# Altium schematic sheet 06_LMS7002M_RF.SchDoc: LMS7002M RF
size A3; Organization: Lime Microsystems; Address1: Surrey Tech Centre; Address2: Guildford GU2 7YG; Address3: Surrey; Address4: United Kingdom; SheetNumber: 6
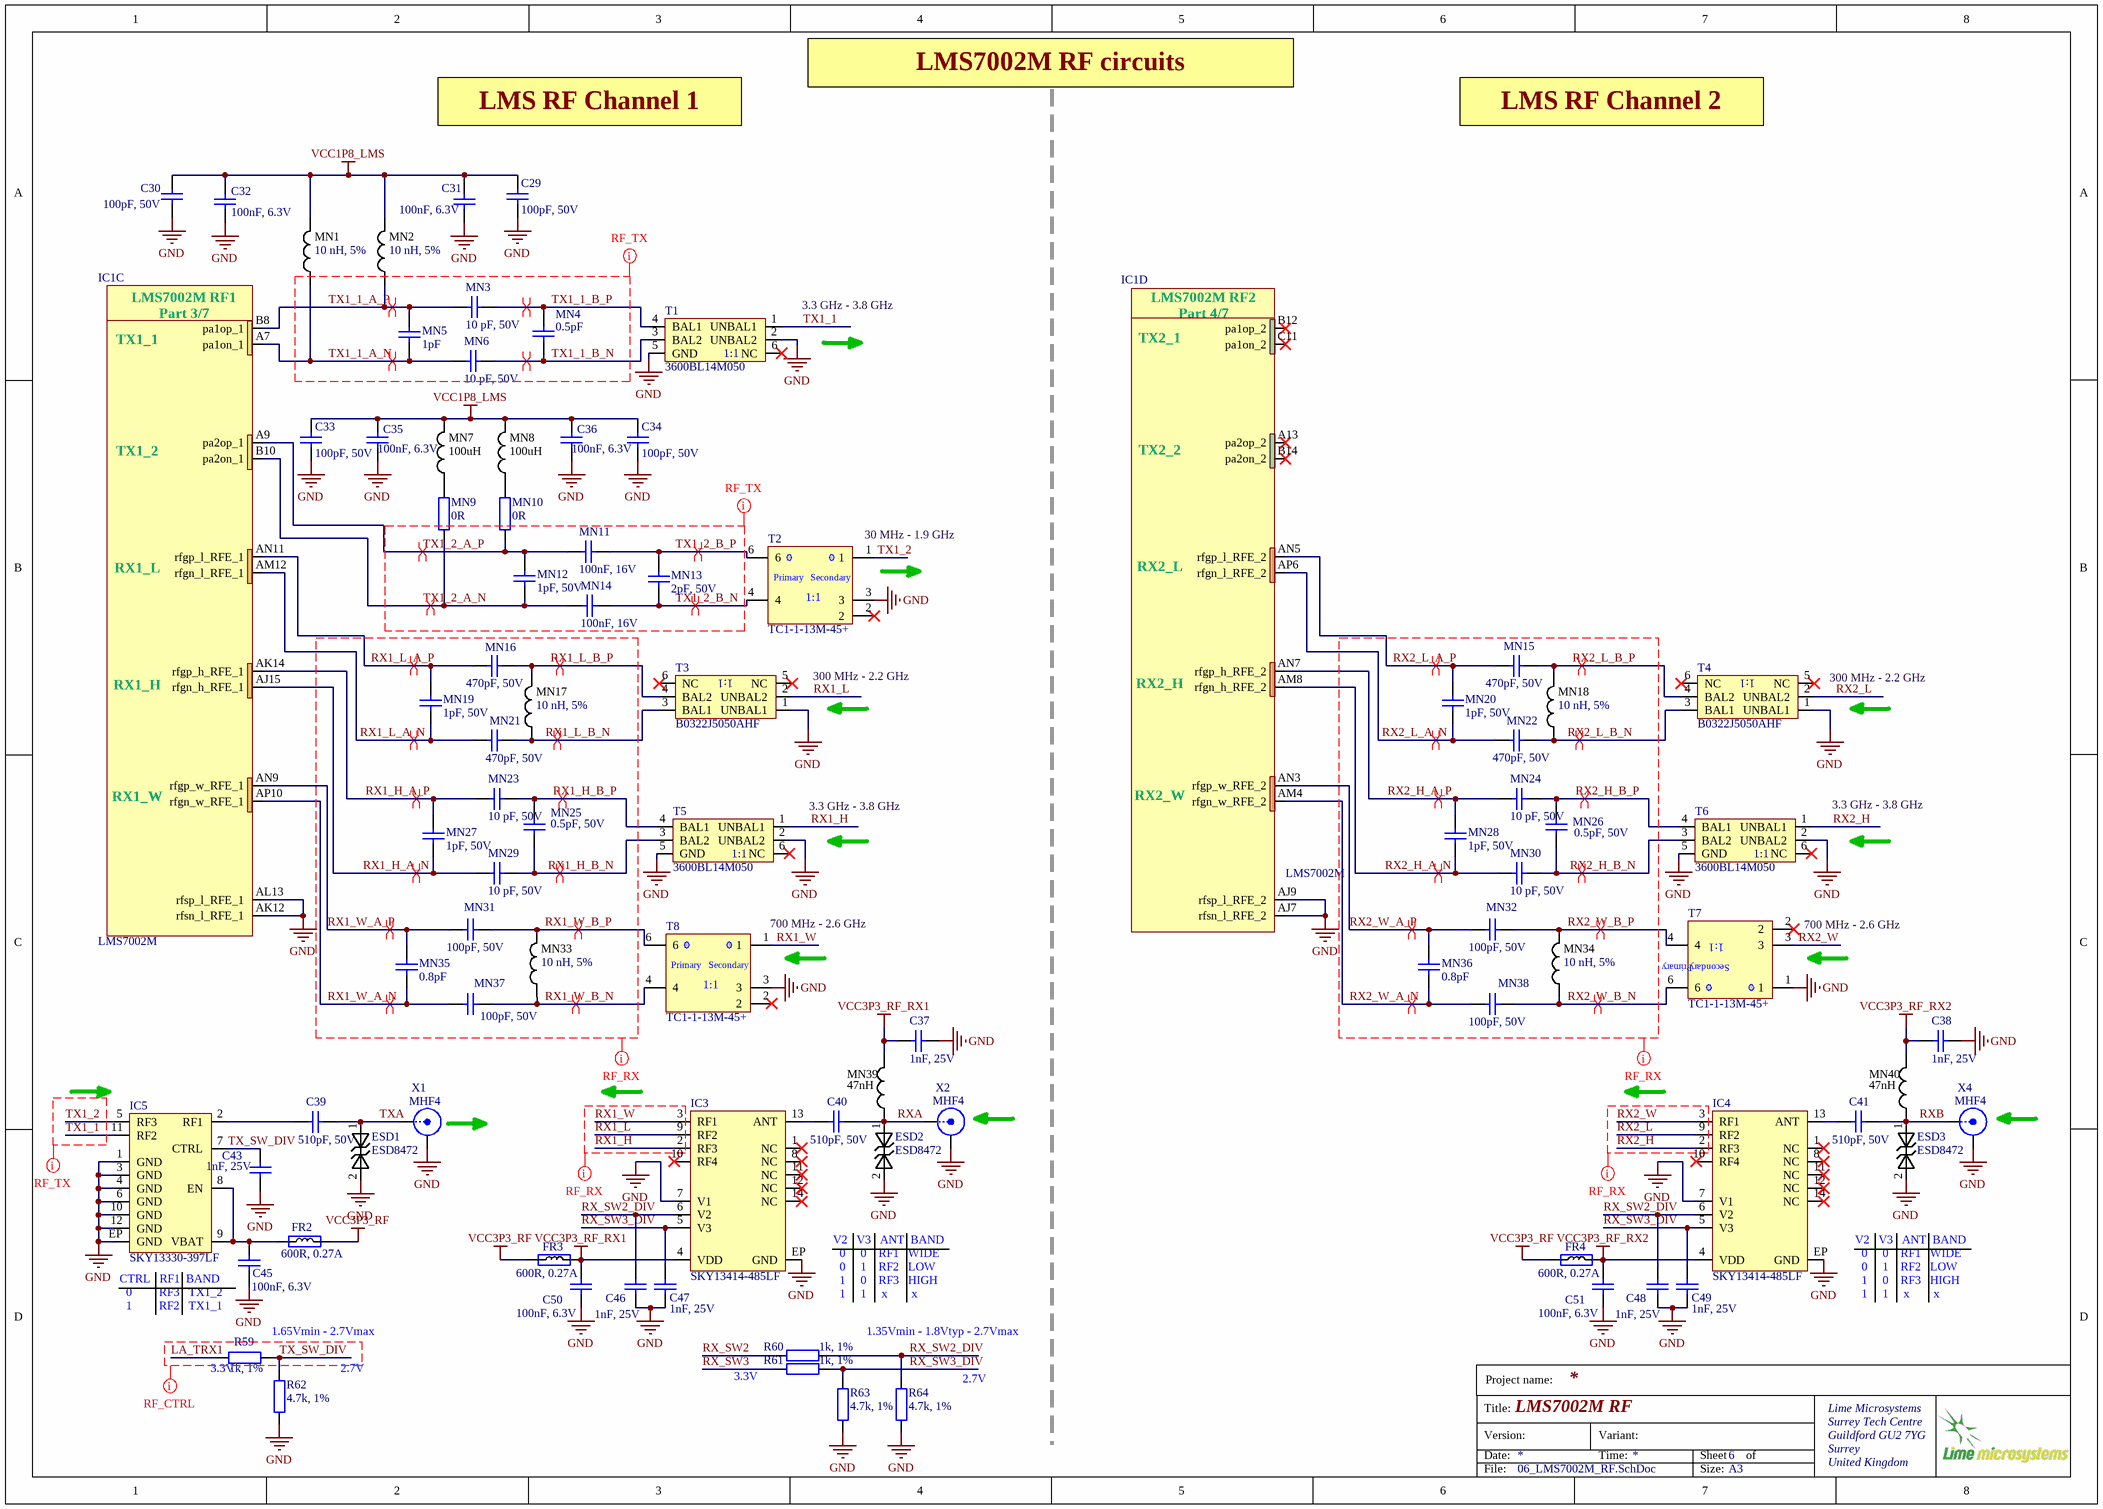
[diagram p0: 06_LMS7002M_RF.SchDoc]

## Parts
C29  100pF, 50V  [CAP0201]
C30  100pF, 50V  [CAP0201]
C31  100nF, 6.3V  [CAP0201]
C32  100nF, 6.3V  [CAP0201]
C33  100pF, 50V  [CAP0201]
C34  100pF, 50V  [CAP0201]
C35  100nF, 6.3V  [CAP0201]
C36  100nF, 6.3V  [CAP0201]
C37  1nF, 25V  [CAP0201]
C38  1nF, 25V  [CAP0201]
C39  510pF, 50V  [CAP0402]
C40  510pF, 50V  [CAP0402]
C41  510pF, 50V  [CAP0402]
C43  1nF, 25V  [CAP0201]
C45  100nF, 6.3V  [CAP0201]
C46  1nF, 25V  [CAP0201]
C47  1nF, 25V  [CAP0201]
C48  1nF, 25V  [CAP0201]
C49  1nF, 25V  [CAP0201]
C50  100nF, 6.3V  [CAP0201]
C51  100nF, 6.3V  [CAP0201]
ESD1  ESD8472  [ESD8472_X3DFN2]
ESD2  ESD8472  [ESD8472_X3DFN2]
ESD3  ESD8472  [ESD8472_X3DFN2]
FR2  600R, 0.27A  [RES0201]
FR3  600R, 0.27A  [RES0201]
FR4  600R, 0.27A  [RES0201]
IC1  LMS7002M  [LMS7002M_v5_LESS_SILK]  (parts C,D of 7)
IC3  SKY13414-485LF  [SKY13414-485LF_RF_SW_QFN14]
IC4  SKY13414-485LF  [SKY13414-485LF_RF_SW_QFN14]
IC5  SKY13330-397LF  [SKY13330-397LF_RF_SW_QFN12]
MN1  10 nH, 5%  [RES0402]
MN2  10 nH, 5%  [RES0402]
MN3  10 pF, 50V  [CAP0402]
MN4  0.5pF  [CAP0402]
MN5  1pF  [CAP0402]
MN6  10 pF, 50V  [CAP0402]
MN7  100uH  [RES0805]
MN8  100uH  [RES0805]
MN9  0R  [RES0402]
MN10  0R  [RES0402]
MN11  100nF, 16V  [CAP0402]
MN12  1pF, 50V  [CAP0402]
MN13  2pF, 50V  [CAP0402]
MN14  100nF, 16V  [CAP0402]
MN15  470pF, 50V  [CAP0402]
MN16  470pF, 50V  [CAP0402]
MN17  10 nH, 5%  [RES0402]
MN18  10 nH, 5%  [RES0402]
MN19  1pF, 50V  [CAP0402]
MN20  1pF, 50V  [CAP0402]
MN21  470pF, 50V  [CAP0402]
MN22  470pF, 50V  [CAP0402]
MN23  10 pF, 50V  [CAP0402]
MN24  10 pF, 50V  [CAP0402]
MN25  0.5pF, 50V  [CAP0402]
MN26  0.5pF, 50V  [CAP0402]
MN27  1pF, 50V  [CAP0402]
MN28  1pF, 50V  [CAP0402]
MN29  10 pF, 50V  [CAP0402]
MN30  10 pF, 50V  [CAP0402]
MN31  100pF, 50V  [CAP0402]
MN32  100pF, 50V  [CAP0402]
MN33  10 nH, 5%  [RES0402]
MN34  10 nH, 5%  [RES0402]
MN35  0.8pF  [CAP0402]
MN36  0.8pF  [CAP0402]
MN37  100pF, 50V  [CAP0402]
MN38  100pF, 50V  [CAP0402]
MN39  47nH  [RES0402]
MN40  47nH  [RES0402]
R59  1k, 1%  [RES0201]
R60  1k, 1%  [RES0201]
R61  1k, 1%  [RES0201]
R62  4.7k, 1%  [RES0201]
R63  4.7k, 1%  [RES0201]
R64  4.7k, 1%  [RES0201]
T1  3600BL14M050  [3600BL14M050_balun_0603]
T2  TC1-1-13M-45+  [TC1-1-13MA+_JA4220-AL_]
T3  B0322J5050AHF  [Anaren_0805_balun_B0322J5050AHF]
T4  B0322J5050AHF  [Anaren_0805_balun_B0322J5050AHF]
T5  3600BL14M050  [3600BL14M050_balun_0603]
T6  3600BL14M050  [3600BL14M050_balun_0603]
T7  TC1-1-13M-45+  [TC1-1-13MA+_JA4220-AL_]
T8  TC1-1-13M-45+  [TC1-1-13MA+_JA4220-AL_]
X1  MHF4  [IPEX_MHF4_conn]
X2  MHF4  [IPEX_MHF4_conn]
X4  MHF4  [IPEX_MHF4_conn]

## Nets
GND: C29.1 C30.1 C31.2 C32.2 C33.1 C34.1 C35.2 C36.2 C37.2 C38.2 C43.2 C45.2 C46.2 C47.2 C48.2 C49.2 C50.2 C51.2 ESD1.2 ESD2.2 ESD3.2 IC1.AJ7(rfsn_l_RFE_2) IC1.AJ9(rfsp_l_RFE_2) IC1.AK12(rfsn_l_RFE_1) IC1.AL13(rfsp_l_RFE_1) IC3.7(V1) IC3.EP(GND) IC4.7(V1) IC4.EP(GND) IC5.1(GND) IC5.3(GND) IC5.4(GND) IC5.6(GND) IC5.10(GND) IC5.12(GND) IC5.EP(GND) R62.2 R63.2 R64.2 T1.2(UNBAL2) T1.5(GND) T2.3 T3.1(UNBAL1) T4.1(UNBAL1) T5.2(UNBAL2) T5.5(GND) T6.2(UNBAL2) T6.5(GND) T7.1 T8.3 X1.2(Y) X2.2(Y) X4.2(Y)
VCC1P8_LMS: C29.2 C30.2 C31.1 C32.1 C33.2 C34.2 C35.1 C36.1 MN1.2 MN2.2 MN7.2 MN8.2
VCC3P3_RF: FR2.1 FR3.2 FR4.2
VCC3P3_RF_RX1: C37.1 C50.1 FR3.1 IC3.4(VDD) MN39.2
VCC3P3_RF_RX2: C38.1 C51.1 FR4.1 IC4.4(VDD) MN40.2
LA_TRX1: R59.2
RX1_H: IC3.2(RF3) T5.1(UNBAL1)
RX1_H_A_N: IC1.AJ15(rfgn_h_RFE_1) MN27.1 MN29.2
RX1_H_A_P: IC1.AK14(rfgp_h_RFE_1) MN23.2 MN27.2
RX1_H_B_N: MN25.1 MN29.1 T5.3(BAL2)
RX1_H_B_P: MN23.1 MN25.2 T5.4(BAL1)
RX1_L: IC3.9(RF2) T3.2(UNBAL2)
RX1_L_A_N: IC1.AM12(rfgn_l_RFE_1) MN19.1 MN21.2
RX1_L_A_P: IC1.AN11(rfgp_l_RFE_1) MN16.2 MN19.2
RX1_L_B_N: MN17.1 MN21.1 T3.3(BAL1)
RX1_L_B_P: MN16.1 MN17.2 T3.4(BAL2)
RX1_W: IC3.3(RF1) T8.1
RX1_W_A_N: IC1.AP10(rfgn_w_RFE_1) MN35.1 MN37.2
RX1_W_A_P: IC1.AN9(rfgp_w_RFE_1) MN31.2 MN35.2
RX1_W_B_N: MN33.1 MN37.1 T8.4
RX1_W_B_P: MN31.1 MN33.2 T8.6
RX2_H: IC4.2(RF3) T6.1(UNBAL1)
RX2_H_A_N: IC1.AM8(rfgn_h_RFE_2) MN28.1 MN30.2
RX2_H_A_P: IC1.AN7(rfgp_h_RFE_2) MN24.2 MN28.2
RX2_H_B_N: MN26.1 MN30.1 T6.3(BAL2)
RX2_H_B_P: MN24.1 MN26.2 T6.4(BAL1)
RX2_L: IC4.9(RF2) T4.2(UNBAL2)
RX2_L_A_N: IC1.AP6(rfgn_l_RFE_2) MN20.1 MN22.2
RX2_L_A_P: IC1.AN5(rfgp_l_RFE_2) MN15.2 MN20.2
RX2_L_B_N: MN18.1 MN22.1 T4.3(BAL1)
RX2_L_B_P: MN15.1 MN18.2 T4.4(BAL2)
RX2_W: IC4.3(RF1) T7.3
RX2_W_A_N: IC1.AM4(rfgn_w_RFE_2) MN36.1 MN38.2
RX2_W_A_P: IC1.AN3(rfgp_w_RFE_2) MN32.2 MN36.2
RX2_W_B_N: MN34.1 MN38.1 T7.6
RX2_W_B_P: MN32.1 MN34.2 T7.4
RX_SW2: R60.2
RX_SW2_DIV: C46.1 C48.1 IC3.6(V2) IC4.6(V2) R60.1 R64.1
RX_SW3: R61.2
RX_SW3_DIV: C47.1 C49.1 IC3.5(V3) IC4.5(V3) R61.1 R63.1
RXA: C40.1 ESD2.1 MN39.1 X2.1(X)
RXB: C41.1 ESD3.1 MN40.1 X4.1(X)
TX1_1: IC5.11(RF2) T1.1(UNBAL1)
TX1_1_A_N: IC1.A7(pa1on_1) MN1.1 MN5.1 MN6.2
TX1_1_A_P: IC1.B8(pa1op_1) MN2.1 MN3.1 MN5.2
TX1_1_B_N: MN4.2 MN6.1 T1.3(BAL2)
TX1_1_B_P: MN3.2 MN4.1 T1.4(BAL1)
TX1_2: IC5.5(RF3) T2.1
TX1_2_A_N: IC1.B10(pa2on_1) MN9.1 MN12.2 MN14.1
TX1_2_A_P: IC1.A9(pa2op_1) MN10.1 MN11.2 MN12.1
TX1_2_B_N: MN13.1 MN14.2 T2.4
TX1_2_B_P: MN11.1 MN13.2 T2.6
TX_SW_DIV: C43.1 IC5.7(CTRL) R59.1 R62.1
TXA: C39.1 ESD1.1 X1.1(X)
NetC39_2: C39.2 IC5.2(RF1)
NetC40_2: C40.2 IC3.13(ANT)
NetC41_2: C41.2 IC4.13(ANT)
NetC45_1: C45.1 FR2.2 IC5.8(EN) IC5.9(VBAT)
NetMN7_1: MN7.1 MN9.2
NetMN8_1: MN8.1 MN10.2

Not connected (* = marked no-connect by the designer): IC1 A13(pa2op_2)* B12(pa1op_2)* B14(pa2on_2)* C11(pa1on_2)*; IC3 1(NC)* 8(NC)* 10(RF4)* 11(NC)* 12(NC)* 14(NC)*; IC4 1(NC)* 8(NC)* 10(RF4)* 11(NC)* 12(NC)* 14(NC)*; T1 6(NC)*; T2 2*; T3 5(NC)* 6(NC)*; T4 5(NC)* 6(NC)*; T5 6(NC)*; T6 6(NC)*; T7 2*; T8 2*

## Layout directives
differential pair: RX1_H_A_N, RX1_H_A_P, RX1_H_B_N, RX1_H_B_P, RX1_L_A_N, RX1_L_A_P, RX1_L_B_N, RX1_L_B_P, RX1_W_A_N, RX1_W_A_P, RX1_W_B_N, RX1_W_B_P, RX2_H_A_N, RX2_H_A_P, RX2_H_B_N, RX2_H_B_P, RX2_L_A_N, RX2_L_A_P, RX2_L_B_N, RX2_L_B_P, RX2_W_A_N, RX2_W_A_P, RX2_W_B_N, RX2_W_B_P, TX1_1_A_N, TX1_1_A_P, TX1_1_B_N, TX1_1_B_P, TX1_2_A_N, TX1_2_A_P, TX1_2_B_N, TX1_2_B_P
net class RF_RX: RX1_H, RX1_H_A_N, RX1_H_A_P, RX1_H_B_N, RX1_H_B_P, RX1_L, RX1_L_A_N, RX1_L_A_P, RX1_L_B_N, RX1_L_B_P, RX1_W, RX1_W_A_N, RX1_W_A_P, RX1_W_B_N, RX1_W_B_P, RX2_H, RX2_H_A_N, RX2_H_A_P, RX2_H_B_N, RX2_H_B_P, RX2_L, RX2_L_A_N, RX2_L_A_P, RX2_L_B_N, RX2_L_B_P, RX2_W, RX2_W_A_N, RX2_W_A_P, RX2_W_B_N, RX2_W_B_P
net class RF_TX: TX1_1, TX1_1_A_N, TX1_1_A_P, TX1_1_B_N, TX1_1_B_P, TX1_2, TX1_2_A_N, TX1_2_A_P, TX1_2_B_N, TX1_2_B_P
net class RF_CTRL: LA_TRX1, TX_SW_DIV

## Notes on the sheet
- LMS7002M RF circuits
- LMS RF Channel 1
- LMS RF Channel 2
- (near T1) 3.3 GHz - 3.8 GHz
- (near T2) 30 MHz - 1.9 GHz
- 300 MHz - 2.2 GHz
- (near T4) 300 MHz - 2.2 GHz
- (near T5) 3.3 GHz - 3.8 GHz
- (near T6) 3.3 GHz - 3.8 GHz
- (near T8) 700 MHz - 2.6 GHz
- (near T7) 700 MHz - 2.6 GHz
- V2   V3   ANT  BAND
- 0     0    RF1   WIDE
- CTRL   RF1  BAND
- (near C45) 0         RF3   TX1_2
- 1         RF2   TX1_1
- 0     1    RF2   LOW
- 1     0    RF3   HIGH
- 1     1     x        x
- (near IC4) 0     1    RF2   LOW
- (near R59) 3.3V
- (near R59) 1.65Vmin - 2.7Vmax
- 2.7V
- 3.3V
- 1.35Vmin - 1.8Vtyp - 2.7Vmax
- (near R64) 2.7V
- Project name:
- Title:
- Version:
- Date:
- Variant:
- Time:
- Sheet
- of
- File:
- Size:
- A3
- (in symbol LMS7002Mr4, part C) LMS7002M RF1; Part 3/7; TX1_1; TX1_2; RX1_L; RX1_H; RX1_W
- (in symbol LMS7002Mr4, part D) LMS7002M RF2; Part 4/7; TX2_1; TX2_2; RX2_L; RX2_H; RX2_W
- (in symbol TC1-1-13M+) 1:1; Primary; Secondary

## Library data of the parts
C29 = Cap_0402: Part Description: 100 pF ±5% 50V Ceramic Capacitor C0G, NP0 0201 (0603 Metric); Manufacturer: TDK; Manufacturer Part Number 1: C0603C0G1H101J030BA; Dielectric Material: Ceramic; Tolerance: 5%; Dielectric: C0G; Insulation Resistance: 10GR; Value: 100pF, 50V; Supplier 1: Digi-Key; Supplier Part Number 1: 445-1786-1-ND; Stock 1: 367528; Pricing 1: 1=0,10000, 10=0,06000, 50=0,03280, 100=0,02670, 500=0,01908, 1000=0,01500, 2500=0,01364, 5000=0,01254 (USD); RoHS: Yes; Mount: Surface Mount; Case/Package: 0201; Number of Pins: 2; Case Code (Metric): 0603; Case Code (Imperial): 0201; Weight: 6E-06oz; Min Operating Temperature: -55°C; Max Operating Temperature: 125°C; Package Quantity: 1; Capacitance: 100pF; Voltage Rating: 50V; Packaging: Tape and Reel; Voltage Rating (DC): 50V; Termination: SMD/SMT; Voltage: 50V; Series: C; Construction: Flat; Length: 0.6mm; Width: 0.012inch; Height: 0.3mm; Thickness: 0.013inch; Depth: 0.3mm; Reach SVHC Compliant: Yes; Lead Free: Lead Free; RoHS Compliant: Yes; ComponentLink1URL: https://datasheet.ciiva.com/24217/c0603c0g1h101j030ba-264106-24217425.pdf?src-supplier=Mouser; ComponentLink1Description: https://datasheet.ciiva.com/24217/c0603c0g1h101j030ba-264106-24217425.pdf?src-supplier=Mouser; ComponentLink2URL: https://datasheet.ciiva.com/16205/mlcc-commercial-general-en-16205590.pdf?src-supplier=Future+Electronics; ComponentLink2Description: https://datasheet.ciiva.com/16205/mlcc-commercial-general-en-16205590.pdf?src-supplier=Future+Electronics; ComponentLink3URL: https://datasheet.ciiva.com/6250/tdkmlcccaprange-6250351.pdf?src-supplier=Digi-Key; ComponentLink3Description: https://datasheet.ciiva.com/6250/tdkmlcccaprange-6250351.pdf?src-supplier=Digi-Key
C30 C33 C34 = Cap_0402: Part Description: 100 pF ±5% 50V Ceramic Capacitor C0G, NP0 0201 (0603 Metric); Manufacturer: TDK; Manufacturer Part Number 1: C0603C0G1H101J030BA; Dielectric: C0G; Dielectric Material: Ceramic; Insulation Resistance: 10GR; Tolerance: 5%; Value: 100pF, 50V; Capacitance: 100pF; Case/Package: 0201; Case Code (Imperial): 0201; Case Code (Metric): 0603; ComponentLink1Description: https://datasheet.ciiva.com/24217/c0603c0g1h101j030ba-264106-24217425.pdf?src-supplier=Mouser; ComponentLink1URL: https://datasheet.ciiva.com/24217/c0603c0g1h101j030ba-264106-24217425.pdf?src-supplier=Mouser; ComponentLink2Description: https://datasheet.ciiva.com/16205/mlcc-commercial-general-en-16205590.pdf?src-supplier=Future+Electronics; ComponentLink2URL: https://datasheet.ciiva.com/16205/mlcc-commercial-general-en-16205590.pdf?src-supplier=Future+Electronics; ComponentLink3Description: https://datasheet.ciiva.com/6250/tdkmlcccaprange-6250351.pdf?src-supplier=Digi-Key; ComponentLink3URL: https://datasheet.ciiva.com/6250/tdkmlcccaprange-6250351.pdf?src-supplier=Digi-Key; Construction: Flat; Depth: 0.3mm; Height: 0.3mm; Lead Free: Lead Free; Length: 0.6mm; Max Operating Temperature: 125°C; Min Operating Temperature: -55°C; Mount: Surface Mount; Number of Pins: 2; Package Quantity: 1; Packaging: Tape and Reel; Pricing 1: 1=0,10000, 10=0,06000, 50=0,03280, 100=0,02670, 500=0,01908, 1000=0,01500, 2500=0,01364, 5000=0,01254 (USD); Reach SVHC Compliant: Yes; RoHS: Yes; RoHS Compliant: Yes; Series: C; Stock 1: 367528; Supplier 1: Digi-Key; Supplier Part Number 1: 445-1786-1-ND; Termination: SMD/SMT; Thickness: 0.013inch; Voltage: 50V; Voltage Rating (DC): 50V; Voltage Rating: 50V; Weight: 6E-06oz; Width: 0.012inch
C31 C32 C36 C45 C50 C51 = Cap_0402: Part Description: 0.1 µF ±20% 10V Ceramic Capacitor X5R 0201 (0603 Metric); Manufacturer: Samsung; Manufacturer Part Number 1: CL03A104MP3NNNC; Tolerance: 20%; Voltage Rating (DC): 10V; Value: 100nF, 6.3V; Capacitance: 100nF; Case/Package: 0201; Case Code (Imperial): 0201; Case Code (Metric): 0603; ComponentLink5Description: https://datasheet.ciiva.com/25788/cl03a104mp3nnnc-25788272.pdf?src-supplier=Digi-Key; ComponentLink5URL: https://datasheet.ciiva.com/25788/cl03a104mp3nnnc-25788272.pdf?src-supplier=Digi-Key; Length: 0.024inch; Max Operating Temperature: 85°C; Min Operating Temperature: -55°C; Mount: Surface Mount; Package Quantity: 1; Packaging: Tape and Reel; Pricing 1: 1=0,10000, 10=0,03000, 50=0,01640, 100=0,01330, 500=0,00950, 1000=0,00747, 2500=0,00679, 5000=0,00625 (USD); RoHS: Yes; RoHS Compliant: Yes; Series: CL; Stock 1: 3817176; Supplier 1: Digi-Key; Supplier Part Number 1: 1276-1321-1-ND; Thickness: 0.013inch; Voltage Rating: 10V; Width: 0.012inch
C35 = Cap_0402: Part Description: 0.1 µF ±20% 10V Ceramic Capacitor X5R 0201 (0603 Metric); Manufacturer: Samsung; Manufacturer Part Number 1: CL03A104MP3NNNC; Tolerance: 20%; Voltage Rating: 10V; Value: 100nF, 6.3V; Supplier 1: Digi-Key; Supplier Part Number 1: 1276-1321-1-ND; Stock 1: 3817176; Pricing 1: 1=0,10000, 10=0,03000, 50=0,01640, 100=0,01330, 500=0,00950, 1000=0,00747, 2500=0,00679, 5000=0,00625 (USD); RoHS: Yes; Mount: Surface Mount; Case/Package: 0201; Case Code (Metric): 0603; Case Code (Imperial): 0201; Min Operating Temperature: -55°C; Max Operating Temperature: 85°C; Package Quantity: 1; Packaging: Tape and Reel; Capacitance: 100nF; Voltage Rating (DC): 10V; Series: CL; Length: 0.024inch; Width: 0.012inch; Thickness: 0.013inch; RoHS Compliant: Yes; ComponentLink5URL: https://datasheet.ciiva.com/25788/cl03a104mp3nnnc-25788272.pdf?src-supplier=Digi-Key; ComponentLink5Description: https://datasheet.ciiva.com/25788/cl03a104mp3nnnc-25788272.pdf?src-supplier=Digi-Key
C37 C38 C43 C46-C49 = Cap_0402: Manufacturer Part Number 1: C0603X7R1E102K030BA; Manufacturer: TDK Corporation; Part Description: 1000pF ±10% 25V X7R Ceramic Capacitor -55°C ~ 125°C Surface Mount, MLCC 0201 (0603 Metric) 0.024" L x 0.012" W (0.60mm x 0.30mm); Temperature Coefficient: X7R; Tolerance: ±10%; Capacitance: 1000pF; Value: 1nF, 25V; Supplier 1: Digi-Key; Supplier Part Number 1: 445-7275-1-ND; Voltage - Rated: 25V; Features: -; Package / Case: 0201 (0603 Metric); Lead Spacing: -; Mounting Type: Surface Mount, MLCC; Lead Style: -; Height - Seated (Max): -; Operating Temperature: -55°C ~ 125°C; Size / Dimension: 0.024" L x 0.012" W (0.60mm x 0.30mm); Applications: General Purpose; Ratings: -; Thickness (Max): 0.013" (0.33mm); RoHS: RoHS Compliant; Packaging: Cut Tape (CT); Category: Capacitors
C39-C41 = Cap_0402: Manufacturer: Murata Electronics North America; Manufacturer Part Number 1: GRM1555C1H511JA01D; Part Description: 510pF ±5% 50V C0G, NP0 Ceramic Capacitor -55°C ~ 125°C Surface Mount, MLCC 0402 (1005 Metric) 0.039" L x 0.020" W (1.00mm x 0.50mm); Temperature Coefficient: C0G, NP0; Tolerance: ±5%; Value: 510pF, 50V; Supplier 1: Digi-Key; Supplier Part Number 1: 490-3237-1-ND; Height - Seated (Max): -; Features: -; Voltage - Rated: 50V; Size / Dimension: 0.039" L x 0.020" W (1.00mm x 0.50mm); Applications: General Purpose; Lead Spacing: -; Package / Case: 0402 (1005 Metric); Ratings: -; Thickness (Max): 0.022" (0.55mm); Lead Style: -; Operating Temperature: -55°C ~ 125°C; Mounting Type: Surface Mount, MLCC; Capacitance: 510pF; Category: Capacitors; RoHS: RoHS Compliant; Packaging: Cut Tape (CT)
ESD1-ESD3 = ESD8472: Manufacturer: ON Semiconductor; Manufacturer Part Number 1: ESD8472MUT5G; Part Description: TVS DIODE 5.3VWM 14VC X3DFN2; Voltage - Reverse Standoff (Typ): 5.3V (Max); Voltage - Breakdown (Min): 7V; Voltage - Clamping (Max) @ Ipp: 14V; Current - Peak Pulse (10/1000µs): 3A (8/20µs); Power Line Protection: No; Capacitance @ Frequency: 0.2pF @ 1MHz; Supplier 1: Digi-Key; RoHS: RoHS Compliant; Category: Circuit Protection; Stock 1: 2295; Pricing 1: 1=0.39, 10=0.315, 100=0.2142, 500=0.16068, 1000=0.12051 (USD); Packaging: Cut Tape (CT); Part Status: Active; Type: Zener; Power - Peak Pulse: -; Applications: Automotive, RF Antenna; Operating Temperature: -55°C ~ 150°C (TJ); Mounting Type: Surface Mount; Package / Case: 2-XFDFN; Supplier Device Package: 2-X3DFN (0.62x0.32); ComponentLink1URL: http://www.onsemi.com/pub/Collateral/ESD8472-D.PDF; ComponentLink1Description: http://www.onsemi.com/pub/Collateral/ESD8472-D.PDF; Supplier Part Number 1: ESD8472MUT5GOSCT-ND
FR2-FR4 = Ferrite: Manufacturer Part Number 1: BK0603TS601-T; Manufacturer: Taiyo Yuden; Part Description: FERRITE BEAD 600 OHM 0201 1LN; DC Resistance (DCR): 750 mOhm Max; Filter Type: Differential Mode - Single; Impedance @ Frequency: 600 Ohm @ 100MHz; Current Rating: 270mA; Value: 600R@100MHz; Supplier 1: Digi-Key; Supplier Part Number 1: 587-3277-1-ND; Size / Dimension: 0.024" L x 0.012" W (0.60mm x 0.30mm); Package / Case: 0201 (0603 Metric); Height (Max): 0.013" (0.33mm); Mounting Type: Surface Mount; Packaging: Cut Tape (CT); RoHS: RoHS Compliant; Category: Filters
IC1 = LMS7002Mr4: Schematic symbol revision 4. Default footprint - 0.31mm pad; Manufacturer: Lime Microsystems; Part Description: IC FPRF Transceiver LMS7002M; 261 pin aQFN; Supplier 1: Lime Microsystems; Supplier Part Number 1: LMS7002M; Manufacturer Part Number 1: LMS7002M
IC3 IC4 = SKY13414-485LF_RF_SW: Part Description: RF Switch IC General Purpose SP4T 3 GHz 50Ohm 14-QFN (2x2); Manufacturer: Skyworks Solutions; P1dB: 37dBm; Impedance: 50R; Throw Configuration: SP4T; IIP3: 70dBm; Supplier 1: Digi-Key; Supplier Part Number 1: 863-1582-1-ND; Manufacturer Part Number 1: SKY13414-485LF; Stock 1: 43522; Pricing 1: 1=1,35000, 10=1,20700, 25=1,14520, 100=0,94070, 250=0,87936, 500=0,77710, 1000=0,61350 (USD); RoHS: Yes; Case/Package: QFN; Min Operating Temperature: -40°C; Max Operating Temperature: 85°C; Packaging: Tape and Reel; Package Quantity: 3000; RoHS Compliant: Yes; ComponentLink1URL: https://datasheet.ciiva.com/15309/sky13414-485lf-201689g-231640-15309794.pdf?src-supplier=Mouser; ComponentLink1Description: https://datasheet.ciiva.com/15309/sky13414-485lf-201689g-231640-15309794.pdf?src-supplier=Mouser
IC5 = SKY13330-397LF_RF_SW: Part Description: RF Switch IC W-CDMA SPDT 6 GHz 50Ohm 12-QFN (2x2); Manufacturer: Skyworks Solutions; Frequency: 100MHz; Throw Configuration: SPDT; P1dB: 39dBm; Impedance: 50R; Insertion Loss: 0.65dB; Turn-Off Delay Time: 1.6us; Max Frequency: 6GHz; Supplier 1: Digi-Key; Supplier Part Number 1: 863-1643-1-ND; Manufacturer Part Number 1: SKY13330-397LF; Stock 1: 596826; Pricing 1: 1=0,99000, 10=0,88800, 25=0,84280, 100=0,69230, 250=0,64716, 500=0,57190, 1000=0,45150 (USD); RoHS: Yes; Mount: Surface Mount; Case/Package: QFN; Number of Pins: 12; Contact Plating: Tin,Matte; Weight: 0.000776oz; Min Operating Temperature: -40°C; Max Operating Temperature: 85°C; Packaging: Tape and Reel; Package Quantity: 3000; Turn-On Delay Time: 1.6us; Radiation Hardening: No; ComponentLink1URL: https://datasheet.ciiva.com/15100/getdatasheetpartid-656010-15100460.pdf?src-supplier=Verical; ComponentLink1Description: https://datasheet.ciiva.com/15100/getdatasheetpartid-656010-15100460.pdf?src-supplier=Verical
MN1 MN2 MN17 MN18 MN33 MN34 = Inductor_0603: Manufacturer: Murata; Manufacturer Part Number 1: LQW15AN10NJ00D; Part Description: RF Inductors - SMD 10 NH 5%; Core Material: Air,Ferrite; Current Rating: 500mA; Shielding: Unshielded; Q Factor: 25; Self Resonant Frequency: 5.5GHz; Inductance: 10nH; DC Resistance (DCR): 170mR; Test Frequency: 100MHz; Supplier 1: Digi-Key; Supplier Part Number 1: 490-1146-6-ND; Stock 1: 158333; Pricing 1: 1=0,16000, 10=0,14200, 25=0,12600, 50=0,10720, 100=0,09450, 250=0,08664, 500=0,07876, 1000=0,06615, 2500=0,05670 (USD); RoHS: Yes; Mount: Surface Mount; Case/Package: 0402; Weight: 2.8E-05oz; Case Code (Metric): 1005; Case Code (Imperial): 0402; Min Operating Temperature: -55°C; Max Operating Temperature: 125°C; Tolerance: 5%; Package Quantity: 10000; Packaging: Tape and Reel; Max DC Current: 500mA; Termination: SMD/SMT; Resistor Type: Wirewound; DC Current: 500mA; Series: LQW15A_00; Rated Current-Max: 500mA; Length: 1mm; Width: 0.02inch; Height: 0.5mm; Depth: 0.7mm; Radiation Hardening: No; Military Standard: Not; Lead Free: Lead Free; RoHS Compliant: Yes; ComponentLink1URL: https://datasheet.ciiva.com/11799/0900766b8090d800-11799037.pdf?src-supplier=RSComponents; ComponentLink1Description: https://datasheet.ciiva.com/11799/0900766b8090d800-11799037.pdf?src-supplier=RSComponents; ComponentLink2URL: https://datasheet.ciiva.com/1042/l0075s0080lqw15a-00-1042162.pdf?src-supplier=Digi-Key; ComponentLink2Description: https://datasheet.ciiva.com/1042/l0075s0080lqw15a-00-1042162.pdf?src-supplier=Digi-Key; ComponentLink3URL: https://datasheet.ciiva.com/1042/l0075s0080lqw15a-00-1042163.pdf?src-supplier=Digi-Key; ComponentLink3Description: https://datasheet.ciiva.com/1042/l0075s0080lqw15a-00-1042163.pdf?src-supplier=Digi-Key; ComponentLink4URL: https://datasheet.ciiva.com/1042/l0075s0080lqw15a-00-1042164.pdf?src-supplier=Digi-Key; ComponentLink4Description: https://datasheet.ciiva.com/1042/l0075s0080lqw15a-00-1042164.pdf?src-supplier=Digi-Key; ComponentLink5URL: https://datasheet.ciiva.com/8508/l0075s0080lqw15a-00-8508743.pdf?src-supplier=Avnet; ComponentLink5Description: https://datasheet.ciiva.com/8508/l0075s0080lqw15a-00-8508743.pdf?src-supplier=Avnet; ComponentLink6URL: https://datasheet.ciiva.com/18089/getdatasheetpartid-110925-18089287.pdf?src-supplier=Verical; ComponentLink6Description: https://datasheet.ciiva.com/18089/getdatasheetpartid-110925-18089287.pdf?src-supplier=Verical; ComponentLink7URL: https://datasheet.ciiva.com/16210/l0075s0080lqw15a-00-16210412.pdf?src-supplier=Future+Electronics; ComponentLink7Description: https://datasheet.ciiva.com/16210/l0075s0080lqw15a-00-16210412.pdf?src-supplier=Future+Electronics
MN3 MN6 MN23 MN24 MN29 MN30 = Cap_0402: Part Description: 10 pF ±0.5pF 50V Ceramic Capacitor C0G, NP0 0402 (1005 Metric); Manufacturer: Walsin Technologies; Manufacturer Part Number 1: 0402N100D500CT; Capacitance: 10pF; Dielectric: C0G; Applications: General Purpose; Supplier 1: Digi-Key; Supplier Part Number 1: 1292-0402N100D500CT-ND; Stock 1: 66767; Pricing 1: 1=0,10000, 10=0,01200, 50=0,00660, 100=0,00540, 500=0,00388, 1000=0,00306, 2500=0,00278, 5000=0,00256 (USD); RoHS: Yes; Case/Package: 0402; Case Code (Metric): 1005; Case Code (Imperial): 0402; Min Operating Temperature: -55°C; Max Operating Temperature: 125°C; Packaging: Tape and Reel; Voltage Rating (DC): 50V; Voltage Rating: 50V; RoHS Compliant: Yes; ComponentLink1URL: http://www.farnell.com/datasheets/2340522.pdf?src-supplier=Farnell; ComponentLink1Description: http://www.farnell.com/datasheets/2340522.pdf?src-supplier=Farnell; ComponentLink2URL: http://www.farnell.com/datasheets/1958513.pdf?src-supplier=Element14; ComponentLink2Description: http://www.farnell.com/datasheets/1958513.pdf?src-supplier=Element14
MN4 = Cap_0402: Manufacturer: Yageo; Manufacturer Part Number 1: CC0402CRNPO9BNR50; Part Description: 0.50pF ±0.25pF 50V C0G, NP0 Ceramic Capacitor -55°C ~ 125°C Surface Mount, MLCC 0402 (1005 Metric) 0.039" L x 0.020" W (1.00mm x 0.50mm); Capacitance: 0.50pF; Voltage - Rated: 50V; Temperature Coefficient: C0G, NP0; Tolerance: ±0.25pF; Value: 0.5pF; Supplier 1: Digi-Key; Supplier Part Number 1: 311-1001-1-ND; RoHS: RoHS Compliant; Thickness (Max): 0.022" (0.55mm); Features: -; Height - Seated (Max): -; Lead Spacing: -; Applications: General Purpose; Packaging: Cut Tape (CT); Ratings: -; Size / Dimension: 0.039" L x 0.020" W (1.00mm x 0.50mm); Lead Style: -; Mounting Type: Surface Mount, MLCC; Operating Temperature: -55°C ~ 125°C; Package / Case: 0402 (1005 Metric); Category: Capacitors
MN5 = Cap_0402: Manufacturer: TDK Corporation; Manufacturer Part Number 1: C1005C0G1H010B050BA; Part Description: 1pF ±0.1pF 50V C0G, NP0 Ceramic Capacitor -55°C ~ 125°C Surface Mount, MLCC 0402 (1005 Metric) 0.039" L x 0.020" W (1.00mm x 0.50mm); Voltage - Rated: 50V; Temperature Coefficient: C0G, NP0; Tolerance: ±0.1pF; Value: 1pF; Supplier 1: Digi-Key; Supplier Part Number 1: 445-4854-6-ND; Size / Dimension: 0.039" L x 0.020" W (1.00mm x 0.50mm); Lead Spacing: -; Operating Temperature: -55°C ~ 125°C; Thickness (Max): 0.022" (0.55mm); Package / Case: 0402 (1005 Metric); Features: -; Lead Style: -; Applications: General Purpose; Height - Seated (Max): -; Capacitance: 1pF; RoHS: RoHS Compliant; Mounting Type: Surface Mount, MLCC; Packaging: Digi-Reel®; Ratings: -; Category: Capacitors
MN7 MN8 = Inductor_0603: Manufacturer: TDK Corporation; Manufacturer Part Number 1: MLF2012C101KT000; Part Description: FIXED IND 100UH 2MA 3.1 OHM SMD; Q @ Freq: 25 @ 1MHz; Shielding: Shielded; Current Rating: 2mA; Frequency - Self Resonant: 7MHz; Frequency - Test: 1MHz; Material - Core: Ferrite; Tolerance: ±10%; Inductance: 100µH; DC Resistance (DCR): 3.1 Ohm Max; Value: 100uH; Supplier 1: Digi-Key; Supplier Part Number 1: 445-1071-1-ND; Supplier Device Package: 0805 (2012 Metric); Size / Dimension: 0.079" L x 0.049" W (2.00mm x 1.25mm); Operating Temperature: -40°C ~ 85°C; Packaging: Cut Tape (CT); RoHS: RoHS Compliant; Current - Saturation: -; Height - Seated (Max): 0.057" (1.45mm); Package / Case: 0805 (2012 Metric); Mounting Type: Surface Mount; Type: Multilayer; Category: Inductors, Coils, Chokes
MN9 MN10 = Res_0402: Manufacturer: Yageo; Part Description: RES SMD 0.0OHM JUMPER 1/16W 0402; Manufacturer Part Number 1: RC0402JR-070RL; Power (Watts): 0.063W, 1/16W; Resistance (Ohms): 0.0; Tolerance: Jumper; Supplier 1: Digi-Key; Supplier Part Number 1: 311-0.0JRTR-ND; Composition: Thick Film; Package / Case: 0402 (1005 Metric); Category: Resistors; Value: 0R; Features: Moisture Resistant; Height: 0.016" (0.40mm); Number of Terminations: 2; Operating Temperature: -55°C ~ 155°C; Packaging: Tape & Reel (TR); RoHS: RoHS Compliant; Size / Dimension: 0.039" L x 0.020" W (1.00mm x 0.50mm); Supplier Device Package: 0402; Temperature Coefficient: -
MN11 MN14 = Cap_0402: Manufacturer: Murata Electronics; Manufacturer Part Number: GRM155R71C104KA88D; Part Description: 0.10µF ±10% 16V X7R Ceramic Capacitor -55°C ~ 125°C Surface Mount, MLCC 0402 (1005 Metric) 0.039" L x 0.020" W (1.00mm x 0.50mm); Tolerance: 10 %; Capacitance: 0.1 uF; Case Length: 1 mm; Dielectric: X7R; Case Height: 0.5 mm; Temperature Coefficient / Code: +/- 15 %; Value: 100nF, 16V; Supplier 1: Mouser; Supplier Part Number 1: 81-GRM155R71C104KA88; Case Code - in: 0402; RoHS: RoHS Compliant; Operating Temperature Range: - 55 C to + 125 C; Series: GRM; Termination Style: SMD/SMT; Package / Case: 0402 (1005 metric); Voltage Rating DC: 16 V; Type: General Purpose MLCC; Maximum Operating Temperature: + 125 C; Case Code - mm: 1005; Minimum Operating Temperature: - 55 C; Product Category: Low & Medium Capacitance SMD Ceramic Chip Capacitors; Packaging: Reel; Product: General Type MLCCs; Category: Multilayer Ceramic Capacitors MLCC - SMD/SMT; Brand: Murata Electronics; Case Width: 0.5 mm; RoHS - Mouser: Y; Standard Pack Qty: 10000; Minimum Order Quantity: 1; Reeling: True; Manufacturer Part Number 1: GRM155R71C104KA88D
MN12 MN19 MN20 MN27 MN28 = Cap_0402: Manufacturer: TDK Corporation; Manufacturer Part Number 1: C1005C0G1H010B050BA; Part Description: 1pF ±0.1pF 50V C0G, NP0 Ceramic Capacitor -55°C ~ 125°C Surface Mount, MLCC 0402 (1005 Metric) 0.039" L x 0.020" W (1.00mm x 0.50mm); Temperature Coefficient: C0G, NP0; Tolerance: ±0.1pF; Value: 1pF, 50V; Supplier 1: Digi-Key; Supplier Part Number 1: 445-4854-6-ND; Size / Dimension: 0.039" L x 0.020" W (1.00mm x 0.50mm); Lead Spacing: -; Operating Temperature: -55°C ~ 125°C; Thickness (Max): 0.022" (0.55mm); Package / Case: 0402 (1005 Metric); Features: -; Voltage - Rated: 50V; Lead Style: -; Applications: General Purpose; Height - Seated (Max): -; Capacitance: 1pF; RoHS: RoHS Compliant; Mounting Type: Surface Mount, MLCC; Packaging: Digi-Reel®; Ratings: -; Category: Capacitors
MN13 = Cap_0402: Manufacturer Part Number 1: 04025U2R0BAT2A; Manufacturer: AVX; Part Description: SMD Multilayer Ceramic Capacitor, U Series, 2 pF, ± 0.1pF, C0G / NP0, 50 V, 0402 [1005 Metric]; Product Range: U Series; Voltage Rating: 50; SVHC: No SVHC (17-Dec-2014); Capacitance Tolerance: ± 0.1; Ceramic Capacitor Case: 0402 [1005 Metric]; Capacitance: 2; Dielectric Characteristic: C0G / NP0; Value: 2pF, 50V; Supplier 1: Farnell; Supplier Part Number 1: 2332536; Operating Temperature Max: 125; RoHS: YES; Operating Temperature Min: -55; Capacitance Tolerance ±: ± 0.1; Packaging: Cut Tape; MSL: MSL 1 - Unlimited
MN15 MN16 MN21 MN22 = Cap_0402: Manufacturer Part Number: C1005C0G1H471J050BA; Manufacturer: TDK Corporation; Part Description: 470pF ±5% 50V Ceramic Capacitor C0G, NP0 0402 (1005 Metric); Tolerance: ±5%; Temperature Coefficient: C0G, NP0; Value: 470pF, 50V; Supplier 1: Digi-Key; Supplier Part Number 1: 445-2656-6-ND; Ratings: -; Package / Case: 0402 (1005 Metric); Capacitance: 470pF; Packaging: Digi-Reel®; RoHS: RoHS Compliant; Lead Style: -; Thickness (Max): 0.022" (0.55mm); Size / Dimension: 0.039" L x 0.020" W (1.00mm x 0.50mm); Lead Spacing: -; Operating Temperature: -55°C ~ 125°C; Height - Seated (Max): -; Applications: General Purpose; Mounting Type: Surface Mount, MLCC; Voltage - Rated: 50V; Category: Capacitors; Features: -; Manufacturer Part Number 1: C1005C0G1H471J050BA
MN25 MN26 = Cap_0402: Manufacturer: Yageo; Manufacturer Part Number 1: CC0402CRNPO9BNR50; Part Description: 0.50pF ±0.25pF 50V C0G, NP0 Ceramic Capacitor -55°C ~ 125°C Surface Mount, MLCC 0402 (1005 Metric) 0.039" L x 0.020" W (1.00mm x 0.50mm); Capacitance: 0.50pF; Temperature Coefficient: C0G, NP0; Tolerance: ±0.25pF; Value: 0.5pF, 50V; Supplier 1: Digi-Key; Supplier Part Number 1: 311-1001-1-ND; RoHS: RoHS Compliant; Thickness (Max): 0.022" (0.55mm); Features: -; Height - Seated (Max): -; Lead Spacing: -; Voltage - Rated: 50V; Applications: General Purpose; Packaging: Cut Tape (CT); Ratings: -; Size / Dimension: 0.039" L x 0.020" W (1.00mm x 0.50mm); Lead Style: -; Mounting Type: Surface Mount, MLCC; Operating Temperature: -55°C ~ 125°C; Package / Case: 0402 (1005 Metric); Category: Capacitors
MN31 MN32 MN37 MN38 = Cap_0402: Manufacturer Part Number 1: CC0402JRNPO9BN101; Manufacturer: Yageo; Part Description: 100pF ±5% 50V C0G, NP0 Ceramic Capacitor -55°C ~ 125°C Surface Mount, MLCC 0402 (1005 Metric) 0.039" L x 0.020" W (1.00mm x 0.50mm); Tolerance: ±5%; Temperature Coefficient: C0G, NP0; Value: 100pF, 50V; Capacitance: 100pF; Thickness (Max): 0.022" (0.55mm); Size / Dimension: 0.039" L x 0.020" W (1.00mm x 0.50mm); RoHS: RoHS Compliant; Ratings: -; Package / Case: 0402 (1005 Metric); Mounting Type: Surface Mount, MLCC; Height - Seated (Max): -; Features: -; Lead Spacing: -; Voltage - Rated: 50V; Operating Temperature: -55°C ~ 125°C; Packaging: Cut Tape (CT); Applications: General Purpose; Lead Style: -; Supplier 1: Digi-Key; Category: Capacitors; Supplier Part Number 1: 311-1024-1-ND
MN35 MN36 = Cap_0402: Manufacturer: Murata Electronics North America; Manufacturer Part Number 1: GRM1555C1HR80BA01D; Part Description: 0.80pF ±0.1pF 50V C0G, NP0 Ceramic Capacitor -55°C ~ 125°C Surface Mount, MLCC 0402 (1005 Metric) 0.039" L x 0.020" W (1.00mm x 0.50mm); Temperature Coefficient: C0G, NP0; Capacitance: 0.80pF; Voltage - Rated: 50V; Tolerance: ±0.1pF; Value: 0.8pF; Applications: General Purpose; Operating Temperature: -55°C ~ 125°C; Size / Dimension: 0.039" L x 0.020" W (1.00mm x 0.50mm); Features: -; Supplier 1: Digi-Key; Height - Seated (Max): -; Category: Capacitors; Package / Case: 0402 (1005 Metric); Mounting Type: Surface Mount, MLCC; Lead Spacing: -; Thickness (Max): 0.022" (0.55mm); RoHS: RoHS Compliant; Supplier Part Number 1: 490-6269-1-ND; Packaging: Cut Tape (CT); Ratings: -; Lead Style: -
MN39 MN40 = Inductor_0603: Manufacturer: COILCRAFT; Manufacturer Part Number: 0402HP-47NXJLU; Part Description: INDUCTOR, RF, 47NH, 5%, 2.4GHZ, SMD; Product Range:0402HP Series; Inductance:47nH; Inductance Tolerance:± 5%; High Frequency Inductor Case:0402 [1005 Metric]; Self Resonant Frequency Min:2.4GHz; DC Resistance Max:0.58ohm; DC Current Rating:420mA; SVHC: No SVHC (15-Jun-2015); Inductance Tolerance: ± 5%; High Frequency Inductor Case: 0402 [1005 Metric]; Inductance: 47; DC Resistance Max: 0.58; Self Resonant Frequency Min: 2.4; Product Range: 0402; DC Current Rating: 420; Inductor Construction: Wirewound; Supplier 1: Farnell; Supplier Part Number 1: 2285856; Packaging: Cut Tape; Inductor Case Style: 0402 [1005 Metric]; RoHS: Y-EX; value: 47nH; Manufacturer Part Number 1: 0402HP-47NXJLU
R59-R61 = Res_0402: Manufacturer: Yageo; Manufacturer Part Number 1: RC0201FR-071KL; Part Description: 1 kOhms ±1% 0.05W, 1/20W Chip Resistor 0201 (0603 Metric) Moisture Resistant Thick Film; Resistance: 1kR; Power Rating: 50mW; Voltage Rating: 25V; Temperature Coefficient: 200ppm/°C; Value: 1k, 1%; Supplier 1: Digi-Key; Supplier Part Number 1: 311-1KMDKR-ND; Stock 1: 9099863; Pricing 1: 1=0,10000, 10=0,03700, 100=0,01530, 1000=0,00685, 2500=0,00595, 5000=0,00491 (USD); RoHS: Yes; Case/Package: 0201; Case Code (Metric): 0603; Case Code (Imperial): 0201; Contact Plating: Tin,Matte; Min Operating Temperature: -55°C; Max Operating Temperature: 125°C; Package Quantity: 10000; Packaging: Tape and Reel; Tolerance: 1%; Resistor Type: Thick Film; Number of Terminations: 2; Termination: SMD/SMT; Max Power Dissipation: 50mW; Working Voltage: 25V; Features: Moisture Resistant; Series: RC; Resistance Tolerance: 1%; Technology: THICK FILM; Construction: Rectangular; Length: 0.024inch; Width: 0.012inch; Height: 0.01inch; Depth: 0.3mm; Radiation Hardening: No; Military Standard: Not; Lead Free: Lead Free; RoHS Compliant: Yes; ComponentLink1URL: https://datasheet.ciiva.com/7672/1563626-7672204.pdf?src-supplier=Element14; ComponentLink1Description: https://datasheet.ciiva.com/7672/1563626-7672204.pdf?src-supplier=Element14; ComponentLink2URL: https://datasheet.ciiva.com/22698/1563626-22698505.pdf?src-supplier=Element14; ComponentLink2Description: https://datasheet.ciiva.com/22698/1563626-22698505.pdf?src-supplier=Element14; ComponentLink3URL: https://datasheet.ciiva.com/29721/pyu-r-int-thick-7-29721196.pdf?src-supplier=Digi-Key; ComponentLink3Description: https://datasheet.ciiva.com/29721/pyu-r-int-thick-7-29721196.pdf?src-supplier=Digi-Key; ComponentLink4URL: https://datasheet.ciiva.com/29721/pyu-r-int-thick-7-29721195.pdf?src-supplier=Digi-Key; ComponentLink4Description: https://datasheet.ciiva.com/29721/pyu-r-int-thick-7-29721195.pdf?src-supplier=Digi-Key; ComponentLink5URL: https://datasheet.ciiva.com/8896/pyu-rc0201-51-rohs-l-8-8896174.pdf?src-supplier=Avnet; ComponentLink5Description: https://datasheet.ciiva.com/8896/pyu-rc0201-51-rohs-l-8-8896174.pdf?src-supplier=Avnet
R62-R64 = Res_0402: Manufacturer: Yageo; Manufacturer Part Number 1: RC0201FR-074K7L; Part Description: 4.7 kOhms ±1% 0.05W, 1/20W Chip Resistor 0201 (0603 Metric) Moisture Resistant Thick Film; Resistance: 4.7kR; Power Rating: 50mW; Voltage Rating: 25V; Temperature Coefficient: 200ppm/°C; Value: 4.7k, 1%; ComponentLink1URL: https://datasheet.ciiva.com/5924/1563626-5924912.pdf?src-supplier=Farnell; ComponentLink1Description: https://datasheet.ciiva.com/5924/1563626-5924912.pdf?src-supplier=Farnell; ComponentLink2URL: https://datasheet.ciiva.com/22661/1563626-22661319.pdf?src-supplier=Element14; ComponentLink2Description: https://datasheet.ciiva.com/22661/1563626-22661319.pdf?src-supplier=Element14; ComponentLink3URL: https://datasheet.ciiva.com/7672/1563626-7672202.pdf?src-supplier=Element14; ComponentLink3Description: https://datasheet.ciiva.com/7672/1563626-7672202.pdf?src-supplier=Element14; ComponentLink4URL: https://datasheet.ciiva.com/2493/pyu-r-int-thick-7-2493785.pdf?src-supplier=Digi-Key; ComponentLink4Description: https://datasheet.ciiva.com/2493/pyu-r-int-thick-7-2493785.pdf?src-supplier=Digi-Key; ComponentLink5URL: https://datasheet.ciiva.com/2493/pyu-r-int-thick-7-2493786.pdf?src-supplier=Digi-Key; ComponentLink5Description: https://datasheet.ciiva.com/2493/pyu-r-int-thick-7-2493786.pdf?src-supplier=Digi-Key; ComponentLink6URL: https://datasheet.ciiva.com/2493/pyu-r-int-thick-7-2493784.pdf?src-supplier=Digi-Key; ComponentLink6Description: https://datasheet.ciiva.com/2493/pyu-r-int-thick-7-2493784.pdf?src-supplier=Digi-Key; ComponentLink7URL: https://datasheet.ciiva.com/7672/1563626-7672233.pdf?src-supplier=Element14; ComponentLink7Description: https://datasheet.ciiva.com/7672/1563626-7672233.pdf?src-supplier=Element14; ComponentLink8URL: https://datasheet.ciiva.com/2493/pyu-r-int-thick-7-2493812.pdf?src-supplier=Digi-Key; ComponentLink8Description: https://datasheet.ciiva.com/2493/pyu-r-int-thick-7-2493812.pdf?src-supplier=Digi-Key; ComponentLink9URL: https://datasheet.ciiva.com/2493/pyu-r-int-thick-7-2493813.pdf?src-supplier=Digi-Key; ComponentLink9Description: https://datasheet.ciiva.com/2493/pyu-r-int-thick-7-2493813.pdf?src-supplier=Digi-Key; ComponentLink10URL: https://datasheet.ciiva.com/2493/pyu-r-int-thick-7-2493811.pdf?src-supplier=Digi-Key; ComponentLink10Description: https://datasheet.ciiva.com/2493/pyu-r-int-thick-7-2493811.pdf?src-supplier=Digi-Key; ComponentLink11URL: https://datasheet.ciiva.com/8892/pyu-rc0201-51-rohs-l-8-8892942.pdf?src-supplier=Avnet; ComponentLink11Description: https://datasheet.ciiva.com/8892/pyu-rc0201-51-rohs-l-8-8892942.pdf?src-supplier=Avnet; Supplier 1: Digi-Key; Supplier Part Number 1: 311-4.70KMCT-ND; Stock 1: 6149397; Pricing 1: 1=0,10000, 10=0,03700, 100=0,01530, 1000=0,00685, 2500=0,00595, 5000=0,00491 (USD); RoHS: Yes; Case/Package: 0201; Case Code (Metric): 0603; Case Code (Imperial): 0201; Weight: 6E-06oz; Contact Plating: Tin,Matte; Size Code: 0201; Min Operating Temperature: -55°C; Max Operating Temperature: 125°C; Tolerance: 1%; Packaging: Tape and Reel; Package Quantity: 1; Resistor Type: Thick Film; Number of Terminations: 2; Termination: SMD/SMT; Max Power Dissipation: 50mW; Features: Moisture Resistant; Series: RC; Resistance Tolerance: 1%; Construction: Rectangular; Length: 0.6mm; Width: 0.012inch; Height: 0.01inch; Depth: 0.3mm; Radiation Hardening: No; Military Standard: Not; Lead Free: Lead Free; RoHS Compliant: Yes
T1 T5 T6 = 3600BL14M050_balun: Part Description: Signal Conditioning 3.6GHz 1:1 BALUN; Manufacturer: Johanson; Manufacturer Part Number 1: 3600BL14M050T; Impedance: 50R; Frequency: 3.6GHz; Insertion Loss: 1.2dB; Max Frequency: 3.9GHz; Return Loss: 9.5dB; Turns Ratio: 1:1; Min Frequency: 3.3GHz; Supplier 1: Digi-Key; Supplier Part Number 1: 712-1048-1-ND; Stock 1: 41138; Pricing 1: 1=1,19000, 10=1,16900, 25=0,78280, 50=0,69680, 100=0,63840, 250=0,57280, 500=0,56086, 1000=0,40573 (USD); RoHS: Yes; Mount: Surface Mount; Case/Package: 0603; Number of Pins: 6; Case Code (Metric): 1608; Case Code (Imperial): 0603; Min Operating Temperature: -40°C; Max Operating Temperature: 85°C; Package Quantity: 1; Packaging: Tape and Reel; Termination: SMD/SMT; Resistor Type: Ceramic; Series: 3600; Length: 1.6mm; Depth: 0.8mm; Radiation Hardening: No; ComponentLink1URL: https://datasheet.ciiva.com/2788/3600bl14m050-2788852.pdf?src-supplier=Digi-Key; ComponentLink1Description: https://datasheet.ciiva.com/2788/3600bl14m050-2788852.pdf?src-supplier=Digi-Key; ComponentLink2URL: https://datasheet.ciiva.com/22694/1318325-22694755.pdf?src-supplier=Element14; ComponentLink2Description: https://datasheet.ciiva.com/22694/1318325-22694755.pdf?src-supplier=Element14; ComponentLink3URL: https://datasheet.ciiva.com/24072/balun-3600bl14m050-242434-24072532.pdf?src-supplier=Mouser; ComponentLink3Description: https://datasheet.ciiva.com/24072/balun-3600bl14m050-242434-24072532.pdf?src-supplier=Mouser
T2 T7 T8 = TC1-1-13M+: Part Description: RF balun; 1:1 ratio; 3 dB bandwidth: 0.3 MHz to 3.5 GHz; 3.8mm x 3.8mm; Manufacturer: Minicircuits; Supplier 1: Minicircuits; Manufacturer Part Number 1: TC1-1-13M-45+; Supplier Part Number 1: TC1-1-13M-45+
T3 T4 = B0322J5050AHF_balun: Part Description: Signal Conditioning 300-2200MHz 50 Ohm IL=1.6dB; Manufacturer: Anaren; Impedance: 50R; Turns Ratio: 1:1; Insertion Loss: 1.6dB; Supplier 1: Mouser; Supplier Part Number 1: 620-B0322J5050AHF; Manufacturer Part Number 1: B0322J5050AHF; Stock 1: 19367; Pricing 1: 1=1,65000, 10=1,02000, 50=1,02000, 100=0,88300, 1000=0,56100, 10000=0,52800 (USD); RoHS: Yes; Mount: Surface Mount; Case/Package: 0805; Number of Pins: 6; Case Code (Metric): 2012; Case Code (Imperial): 0805; Min Operating Temperature: -55°C; Max Operating Temperature: 85°C; Package Quantity: 1; Packaging: Tape and Reel; Termination: SMD/SMT; Series: Xinger®; Length: 2.04mm; Depth: 1.29mm; RoHS Compliant: Yes; ComponentLink1URL: https://datasheet.ciiva.com/2788/b0322j5050ahf-datasheet-reva-2788996.pdf?src-supplier=Digi-Key; ComponentLink1Description: https://datasheet.ciiva.com/2788/b0322j5050ahf-datasheet-reva-2788996.pdf?src-supplier=Digi-Key; ComponentLink2URL: https://datasheet.ciiva.com/4548/b0322j5050ahf-datasheet-reva-18090-4548378.pdf?src-supplier=Mouser; ComponentLink2Description: https://datasheet.ciiva.com/4548/b0322j5050ahf-datasheet-reva-18090-4548378.pdf?src-supplier=Mouser; ComponentLink3URL: https://datasheet.ciiva.com/2788/b0322j5050ahf-2788997.pdf?src-supplier=Digi-Key; ComponentLink3Description: https://datasheet.ciiva.com/2788/b0322j5050ahf-2788997.pdf?src-supplier=Digi-Key; ComponentLink4URL: https://datasheet.ciiva.com/2788/b0322j5050ahf-2788998.pdf?src-supplier=Digi-Key; ComponentLink4Description: https://datasheet.ciiva.com/2788/b0322j5050ahf-2788998.pdf?src-supplier=Digi-Key; ComponentLink5URL: https://datasheet.ciiva.com/26819/getdatasheetpartid-573228-26819653.pdf?src-supplier=Verical; ComponentLink5Description: https://datasheet.ciiva.com/26819/getdatasheetpartid-573228-26819653.pdf?src-supplier=Verical
X1 X2 X4 = RF_IF_connector: IPEX MHF4 Connector Jack, Male Pin 50 Ohms Surface Mount Solder; Manufacturer: TE Connectivity / Linx Technologies; Manufacturer Part Number 1: CONMHF4-SMD-G-T; Part Description: IPEX MHF4 Connector Jack, Male Pin 50 Ohms Surface Mount Solder; Supplier 1: Digikey; Supplier Part Number 1: 343-CONMHF4-SMD-G-TCT-ND; Stock 1: 15668; Pricing 1: 1=0,22 (USD); RoHS: No